# EAGLE board untitled (EAGLE 6.1)
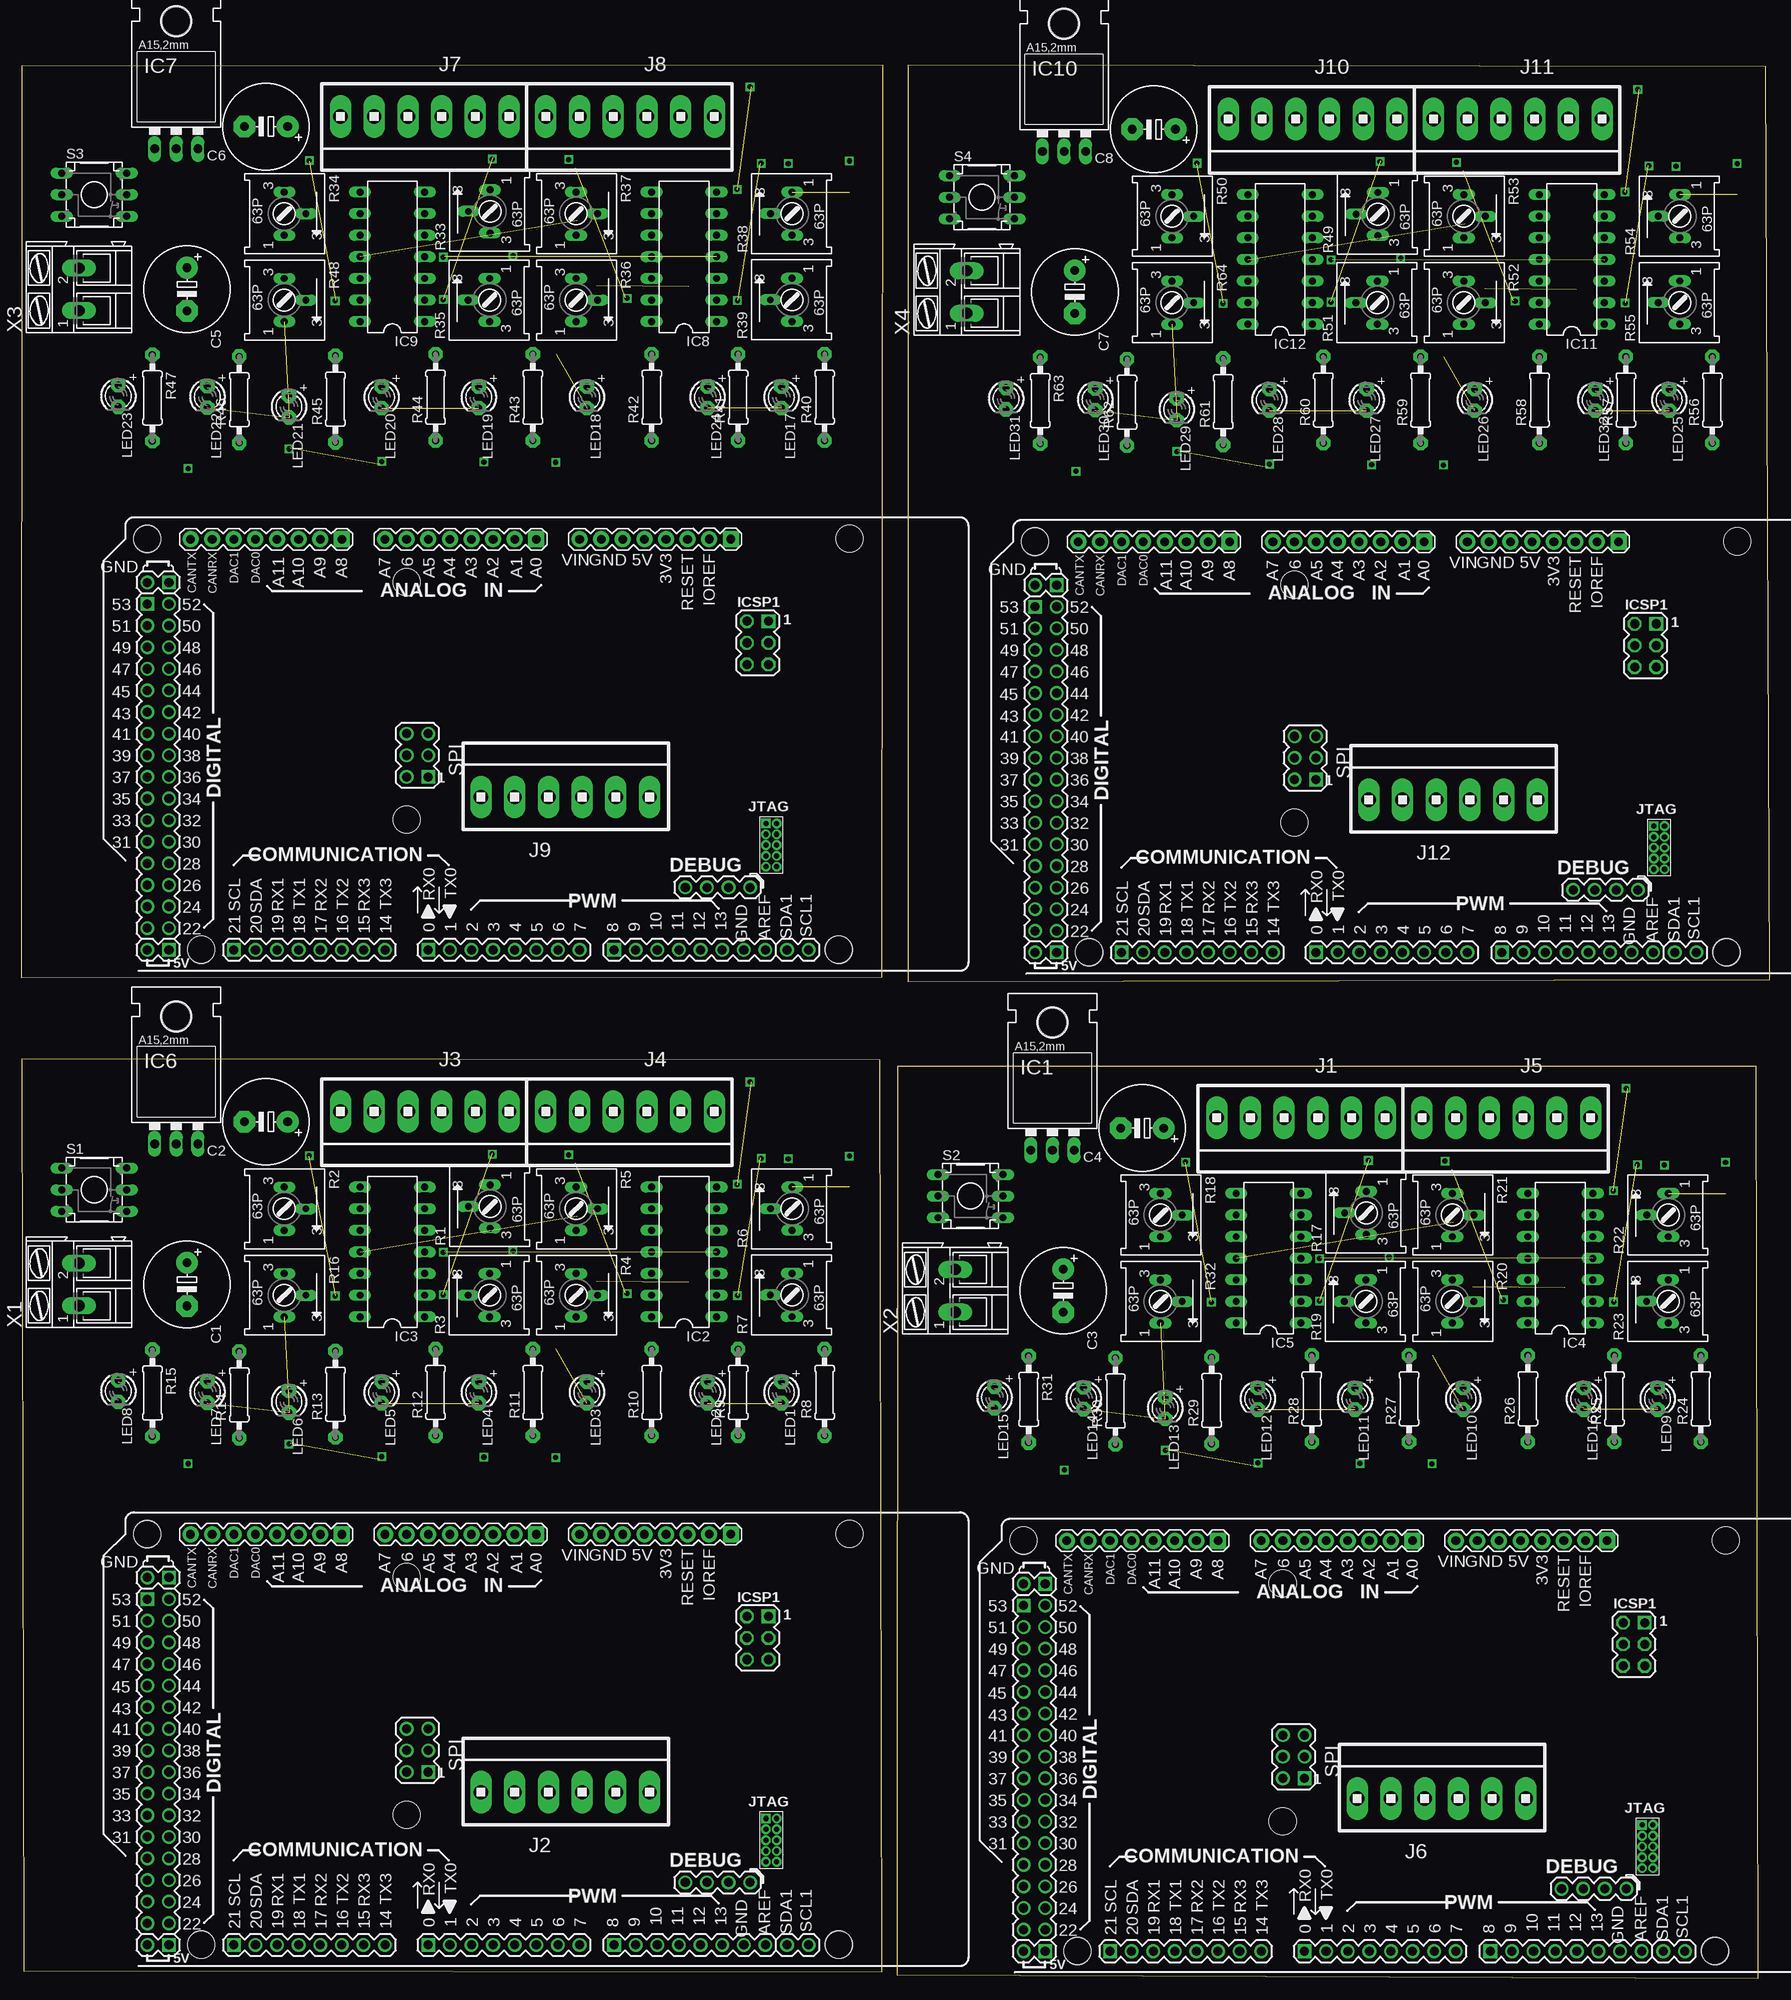
[diagram p4: board, top side]
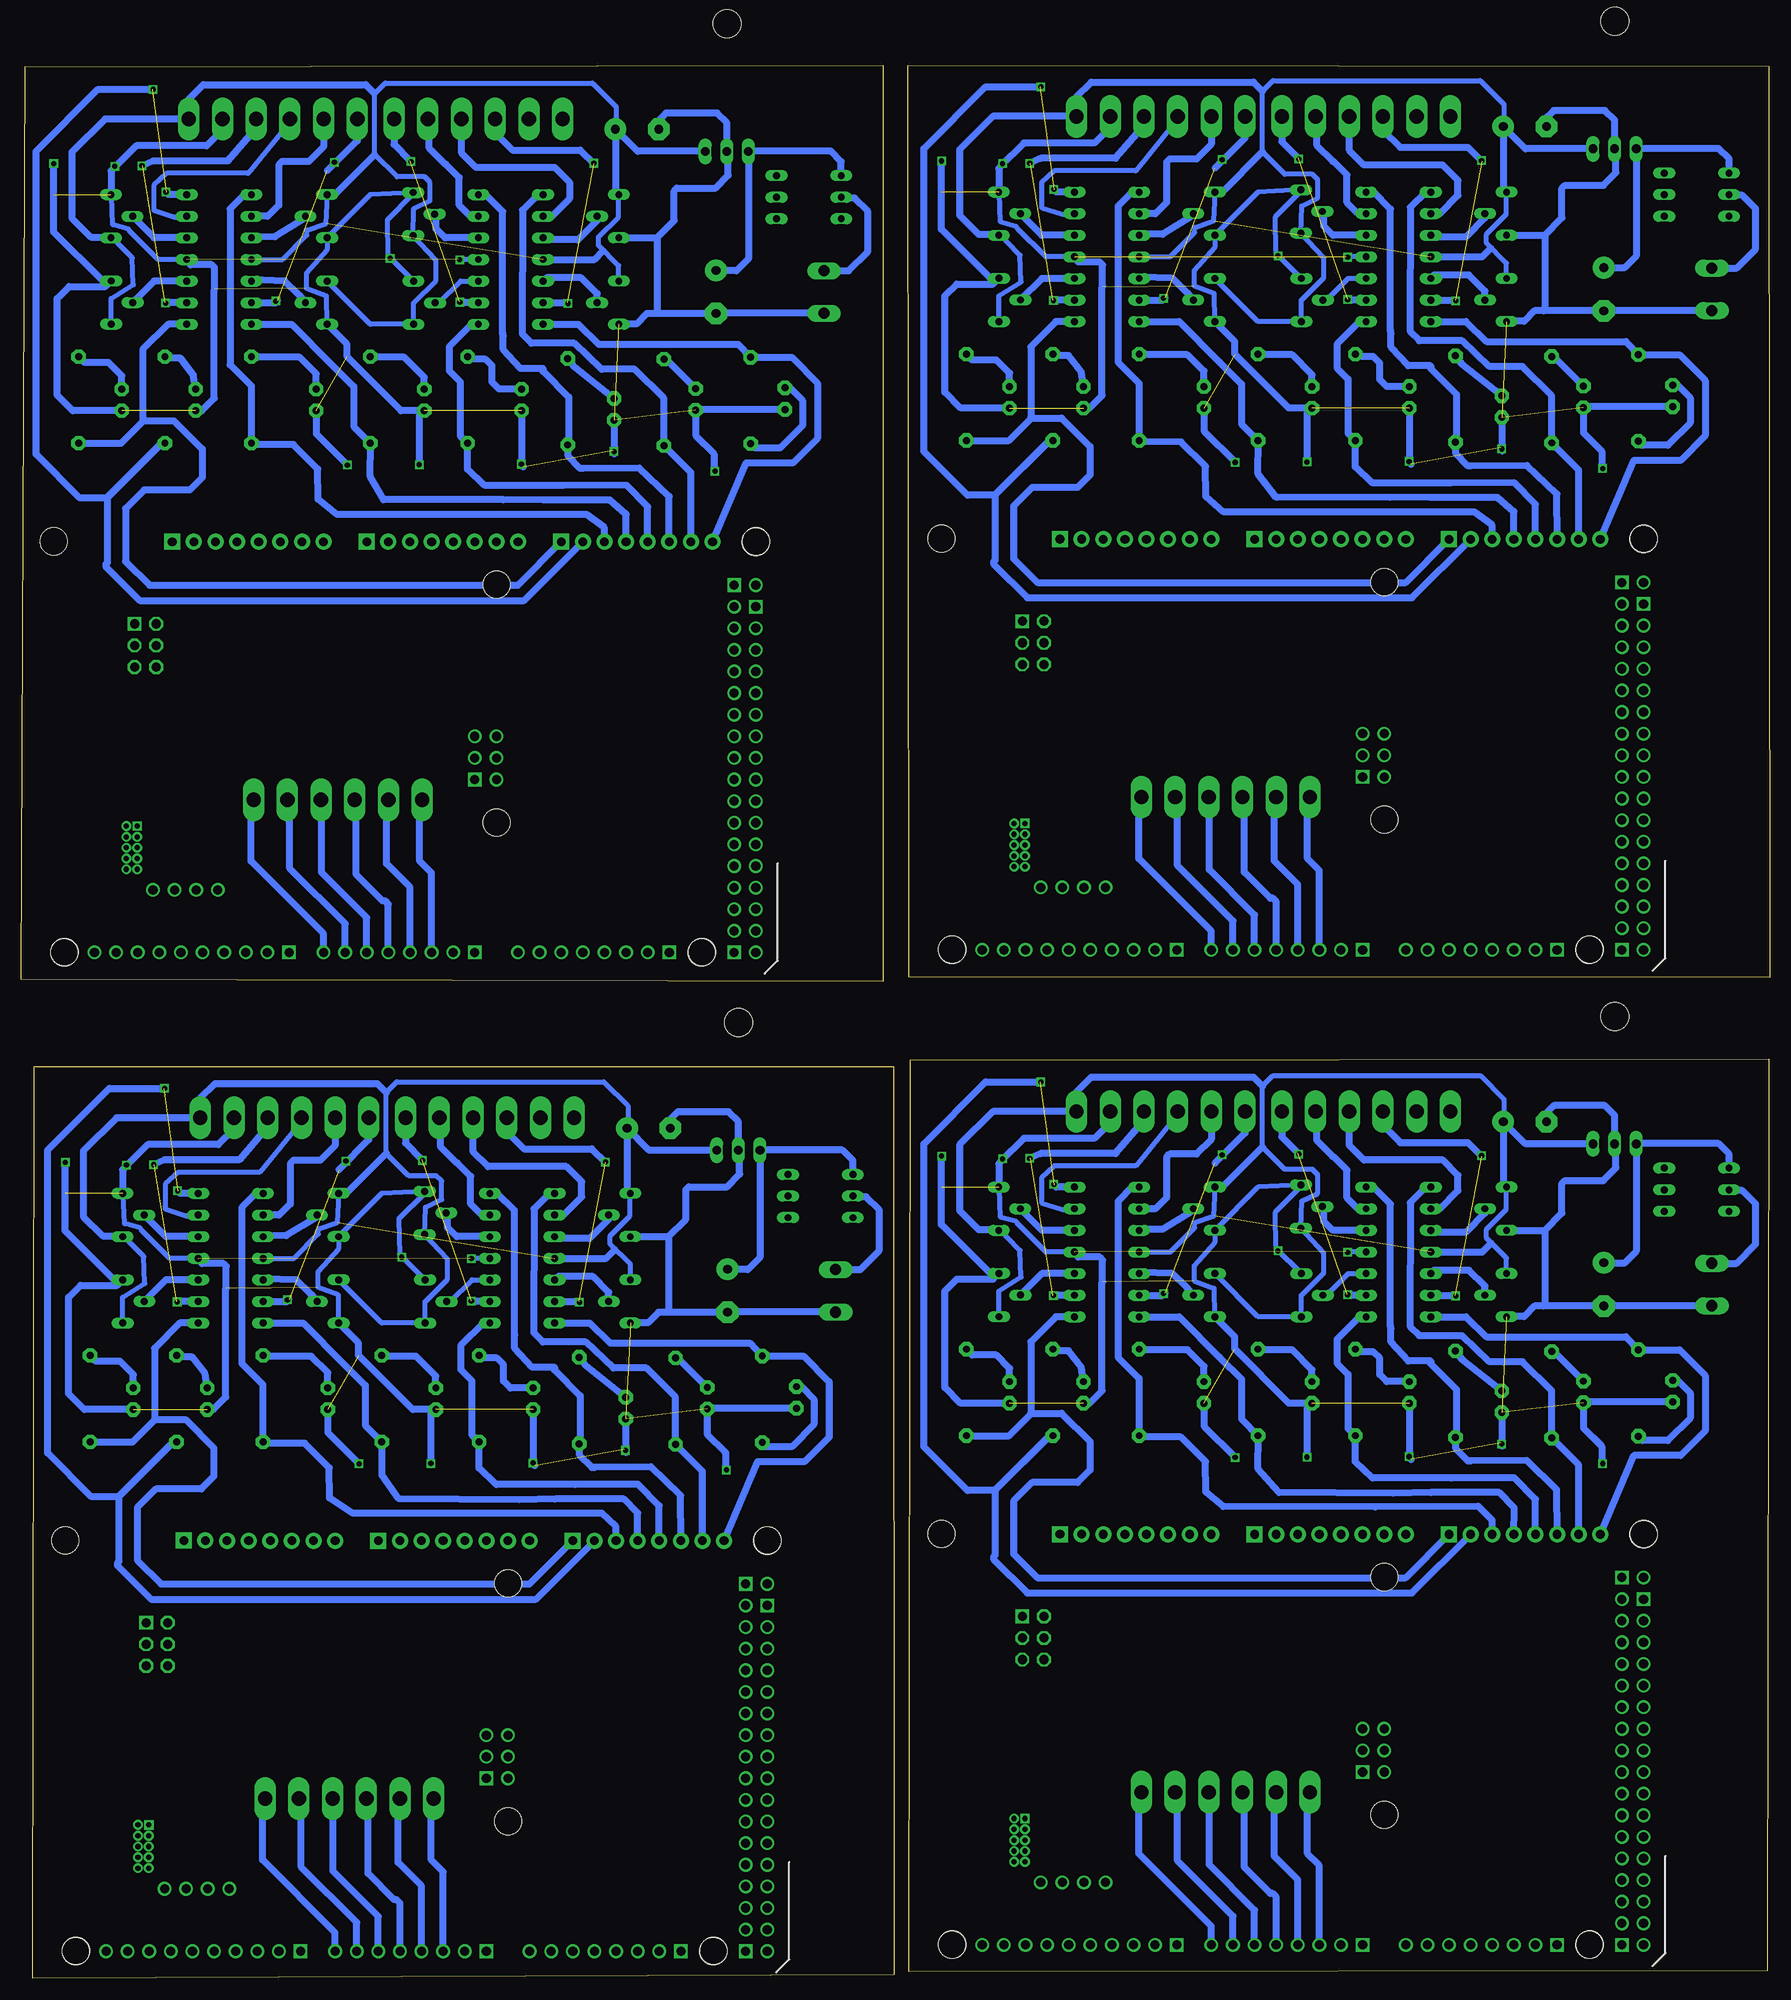
[diagram p5: board, bottom side, seen from below]

Size 205.5 x 224.86 mm. Coordinates in mm from the lower left corner, seen from the top.
Outline: 0.27,0.88 101.15,0.74 100.96,107.9 0.08,108.02 0.27,0.88
Outline: 102.94,0.4 204.14,0 203.94,107.15 103,107.18 102.94,0.4
Outline: 0,117.61 101.15,117.7 101.26,224.86 0.08,224.72 0,117.61
Outline: 104.2,117.17 205.5,117.39 205.05,224.67 104.21,224.83 104.2,117.17
Copper layers (1*16): Top 0.035mm / dielectric 1.5mm / Bottom 0.035mm
Design rules: minimum track width 10mil, minimum drill 24mil, track to track 8mil, track to pad 8mil, pad to pad 8mil, via to via 8mil, smd to smd 8mil, copper to edge 40mil, drill to drill 8mil, minimum pad ring 10mil, minimum via ring 8mil, stop-mask expansion 4mil, vias tented up to drill 0mil, thermal gap 10mil

## Footprints (pad centres in the part's own frame; a part is rotated, then mirrored left to right if it is on the bottom)
ARDUINO_DUE_SHIELD = drill 1.067 square: 0 63.373,51.816; 5V0_1 93.853,51.816; 8 41.529,51.816; 21 86.233,51.816; 53 96.393,11.176; GND_2 93.853,8.636; MISO 63.373,31.496; MISO2 23.384,13.196 | drill 1.067: 1 60.833,51.816; 2 58.293,51.816; 3 55.753,51.816; 4 53.213,51.816; 5 50.673,51.816; 5V0_2 96.393,51.816; 5V_2 65.913,31.496; 6 48.133,51.816; 7 45.593,51.816; 9 38.989,51.816; 10 36.449,51.816; 11 33.909,51.816; 12 31.369,51.816; 13 28.829,51.816; 14 68.453,51.816; 15 70.993,51.816; 16 73.533,51.816; 17 76.073,51.816; 18 78.613,51.816; 19 81.153,51.816; 20 83.693,51.816; 22 93.853,49.276; 23 96.393,49.276; 24 93.853,46.736; 25 96.393,46.736; 26 93.853,44.196; 27 96.393,44.196; 28 93.853,41.656; 29 96.393,41.656; 30 93.853,39.116; 31 96.393,39.116; 32 93.853,36.576; 33 96.393,36.576; 34 93.853,34.036; 35 96.393,34.036; 36 93.853,31.496; 37 96.393,31.496; 38 93.853,28.956; 39 96.393,28.956; 40 93.853,26.416; 41 96.393,26.416; 42 93.853,23.876; 43 96.393,23.876; 44 93.853,21.336; 45 96.393,21.336; 46 93.853,18.796; 47 96.393,18.796; 48 93.853,16.256; 49 96.393,16.256; 50 93.853,13.716; 51 96.393,13.716; 52 93.853,11.176; AREF 23.749,51.816; GND_3 96.393,8.636; GND_4 26.289,51.816; GND_5 65.913,26.416; GND_7 33.161,44.473; JTAG_TCK 30.621,44.473; JTAG_TMS 28.081,44.473; MASTER_RESET_JTAG 25.541,44.473; MASTER_RESET_SPI 63.373,26.416; MOSI 65.913,28.956; SCL1 18.669,51.816; SDA1 21.209,51.816; SPCK 63.373,28.956 | drill 1.016 pad 1.88: 3V3 35.433,3.556; 5V0 37.973,3.556; A1 53.213,3.556; A2 55.753,3.556; A3 58.293,3.556; A4 60.833,3.556; A5 63.373,3.556; A6 65.913,3.556; A7 68.453,3.556; A9 76.073,3.556; A10 78.613,3.556; A11 81.153,3.556; CANRX 88.773,3.556; CANTX 91.313,3.556; DAC0 83.693,3.556; DAC1 86.233,3.556; GND 40.513,3.556; GND_1 43.053,3.556; IOREF 30.346,3.543; RESET 32.893,3.555; VIN 45.593,3.556 | drill 0.6 pad 1.016 square: 3V3_JTAG 23.689,36.964 | drill 1.067 octagon: 5V_ICSP1 25.924,13.196; GND_ICSP1 25.924,18.276; MOSI2 25.924,15.736; RESET2 23.384,18.276; SCK2 23.384,15.736 | drill 1.016 pad 1.88 square: A0 50.673,3.556; A8 73.533,3.556; NC_2 27.806,3.543 | drill 0.6 pad 1.143: GND_8 23.689,38.234; GND_9 23.689,40.774; GND_10 23.689,42.044; JTAG_RESET 22.419,42.044; JTAG_TCK_2 22.419,38.234; JTAG_TDI 22.419,40.774; JTAG_TDO 22.419,39.504; JTAG_TMS_2 22.419,36.964; NC_5 23.689,39.504 | hole 3.2: 15.113,51.816; 90.043,51.816; 96.393,3.556; 96.418,3.505; 15.138,51.765; 90.068,51.765; 13.868,3.505; 65.938,36.525; 65.938,8.585
E5-10,5 = drill 1.016 pad 2.54: + -2.54,0 | drill 1.016 pad 2.54 octagon: - 2.54,0
78XXL = drill 1.016 long: GND 0,-3.81; IN -2.54,-3.81; OUT 2.54,-3.81 | hole 3.302: 0,11.176
DIL14 = drill 0.813 long: 1 -7.62,-3.81; 2 -5.08,-3.81; 3 -2.54,-3.81; 4 0,-3.81; 5 2.54,-3.81; 6 5.08,-3.81; 7 7.62,-3.81; 8 7.62,3.81; 9 5.08,3.81; 10 2.54,3.81; 11 0,3.81; 12 -2.54,3.81; 13 -5.08,3.81; 14 -7.62,3.81
1X6MTA = drill 1.676 long: 1 9.906,0; 2 5.944,0; 3 1.981,0; 4 -1.981,0; 5 -5.944,0; 6 -9.906,0
LED3MM = drill 0.813 pad 1.676 octagon: A -1.27,0; K 1.27,0
S63P = drill 0.813 long: A 2.54,0; E -2.54,0; S 0,2.54
0207/10 = drill 0.813 pad 1.676 octagon: 1 -5.08,0; 2 5.08,0
TME1 = drill 0.813 long: 1 -2.54,-3.81; 2 0,-3.81; 3 2.54,-3.81; 4 2.54,3.81; 5 0,3.81; 6 -2.54,3.81
AK300/2 = drill 1.321 long: 1 -2.515,0; 2 2.489,0

## Placement (x,y rotation side)
ARDUINO_DUE1  [ARDUINO_DUE_SHIELD]  111.21,55.73 180 top
ARDUINO_DUE2  [ARDUINO_DUE_SHIELD]  214.2,54.99 180 top
ARDUINO_DUE3  [ARDUINO_DUE_SHIELD]  111.21,172.69 180 top
ARDUINO_DUE4  [ARDUINO_DUE_SHIELD]  215.56,172.38 180 top
C1  [E5-10,5]  19.49,81.55 270 top
C2  [E5-10,5]  28.77,100.67 180 top
C3  [E5-10,5]  122.48,80.81 270 top
C4  [E5-10,5]  131.75,99.92 180 top
C5  [E5-10,5]  19.49,198.51 270 top
C6  [E5-10,5]  28.77,217.63 180 top
C7  [E5-10,5]  123.83,198.2 270 top
C8  [E5-10,5]  133.11,217.32 180 top
IC1  [78XXL]  121.21,101.13 0 top
IC2  LM2902N  [DIL14]  77.91,85.36 90 top
IC3  LM2902N  [DIL14]  43.62,85.36 90 top
IC4  LM2902N  [DIL14]  180.9,84.62 90 top
IC5  LM2902N  [DIL14]  146.61,84.62 90 top
IC6  [78XXL]  18.22,101.87 0 top
IC7  [78XXL]  18.22,218.83 0 top
IC8  LM2902N  [DIL14]  77.91,202.32 90 top
IC9  LM2902N  [DIL14]  43.62,202.32 90 top
IC10  [78XXL]  122.56,218.52 0 top
IC11  LM2902N  [DIL14]  182.25,202.01 90 top
IC12  LM2902N  [DIL14]  147.96,202.01 90 top
J1  [1X6MTA]  150.42,101.13 180 top
J2  [1X6MTA]  63.94,21.86 0 top
J3  [1X6MTA]  47.43,101.87 180 top
J4  [1X6MTA]  71.56,101.87 180 top
J5  [1X6MTA]  174.55,101.13 180 top
J6  [1X6MTA]  166.93,21.12 0 top
J7  [1X6MTA]  47.43,218.83 180 top
J8  [1X6MTA]  71.56,218.83 180 top
J9  [1X6MTA]  63.94,138.82 0 top
J10  [1X6MTA]  151.77,218.52 180 top
J11  [1X6MTA]  175.9,218.52 180 top
J12  [1X6MTA]  168.28,138.51 0 top
LED1  [LED3MM]  89.34,68.85 270 top
LED2  [LED3MM]  80.65,68.85 270 top
LED3  [LED3MM]  66.48,68.85 270 top
LED4  [LED3MM]  53.78,68.85 270 top
LED5  [LED3MM]  42.35,68.85 270 top
LED6  [LED3MM]  31.46,67.76 270 top
LED7  [LED3MM]  21.88,68.91 270 top
LED8  [LED3MM]  11.4,69 270 top
LED9  [LED3MM]  192.33,68.11 270 top
LED10  [LED3MM]  169.47,68.11 270 top
LED11  [LED3MM]  156.77,68.11 270 top
LED12  [LED3MM]  145.34,68.11 270 top
LED13  [LED3MM]  134.45,67.01 270 top
LED14  [LED3MM]  124.86,68.17 270 top
LED15  [LED3MM]  114.39,68.26 270 top
LED16  [LED3MM]  183.64,68.11 270 top
LED17  [LED3MM]  89.34,185.81 270 top
LED18  [LED3MM]  66.48,185.81 270 top
LED19  [LED3MM]  53.78,185.81 270 top
LED20  [LED3MM]  42.35,185.81 270 top
LED21  [LED3MM]  31.46,184.72 270 top
LED22  [LED3MM]  21.88,185.87 270 top
LED23  [LED3MM]  11.4,185.96 270 top
LED24  [LED3MM]  80.65,185.81 270 top
LED25  [LED3MM]  193.68,185.5 270 top
LED26  [LED3MM]  170.82,185.5 270 top
LED27  [LED3MM]  158.12,185.5 270 top
LED28  [LED3MM]  146.69,185.5 270 top
LED29  [LED3MM]  135.81,184.41 270 top
LED30  [LED3MM]  126.22,185.56 270 top
LED31  [LED3MM]  115.75,185.66 270 top
LED32  [LED3MM]  185,185.5 270 top
R1  [S63P]  55.09,90.7 90 top
R2  [S63P]  30.92,90.44 270 top
R3  [S63P]  55.05,80.28 90 top
R4  [S63P]  65.21,80.28 270 top
R5  [S63P]  65.21,90.44 270 top
R6  [S63P]  90.61,90.44 90 top
R7  [S63P]  90.58,80.3 90 top
R8  [0207/10]  94.42,68.85 90 top
R9  [0207/10]  84.26,68.85 90 top
R10  [0207/10]  74.1,68.85 90 top
R11  [0207/10]  60.13,68.85 90 top
R12  [0207/10]  48.7,68.85 90 top
R13  [0207/10]  36.92,68.65 90 top
R14  [0207/10]  25.62,68.57 90 top
R15  [0207/10]  15.41,68.78 270 top
R16  [S63P]  30.92,80.28 270 top
R17  [S63P]  158.08,89.96 90 top
R18  [S63P]  133.91,89.7 270 top
R19  [S63P]  158.04,79.54 90 top
R20  [S63P]  168.2,79.54 270 top
R21  [S63P]  168.2,89.7 270 top
R22  [S63P]  193.6,89.7 90 top
R23  [S63P]  193.57,79.56 90 top
R24  [0207/10]  197.41,68.11 90 top
R25  [0207/10]  187.25,68.11 90 top
R26  [0207/10]  177.09,68.11 90 top
R27  [0207/10]  163.12,68.11 90 top
R28  [0207/10]  151.69,68.11 90 top
R29  [0207/10]  139.91,67.9 90 top
R30  [0207/10]  128.61,67.83 90 top
R31  [0207/10]  118.4,68.04 270 top
R32  [S63P]  133.91,79.54 270 top
R33  [S63P]  55.09,207.66 90 top
R34  [S63P]  30.92,207.4 270 top
R35  [S63P]  55.05,197.24 90 top
R36  [S63P]  65.21,197.24 270 top
R37  [S63P]  65.21,207.4 270 top
R38  [S63P]  90.61,207.4 90 top
R39  [S63P]  90.58,197.26 90 top
R40  [0207/10]  94.42,185.81 90 top
R41  [0207/10]  84.26,185.81 90 top
R42  [0207/10]  74.1,185.81 90 top
R43  [0207/10]  60.13,185.81 90 top
R44  [0207/10]  48.7,185.81 90 top
R45  [0207/10]  36.92,185.61 90 top
R46  [0207/10]  25.62,185.53 90 top
R47  [0207/10]  15.41,185.74 270 top
R48  [S63P]  30.92,197.24 270 top
R49  [S63P]  159.44,207.35 90 top
R50  [S63P]  135.26,207.09 270 top
R51  [S63P]  159.39,196.93 90 top
R52  [S63P]  169.55,196.93 270 top
R53  [S63P]  169.55,207.09 270 top
R54  [S63P]  194.95,207.09 90 top
R55  [S63P]  194.93,196.95 90 top
R56  [0207/10]  198.76,185.5 90 top
R57  [0207/10]  188.6,185.5 90 top
R58  [0207/10]  178.44,185.5 90 top
R59  [0207/10]  164.47,185.5 90 top
R60  [0207/10]  153.04,185.5 90 top
R61  [0207/10]  141.27,185.3 90 top
R62  [0207/10]  129.96,185.22 90 top
R63  [0207/10]  119.76,185.43 270 top
R64  [S63P]  135.26,196.93 270 top
S1  TME1  [TME1]  8.58,92.67 270 top
S2  TME1  [TME1]  111.57,91.93 270 top
S3  TME1  [TME1]  8.58,209.63 270 top
S4  TME1  [TME1]  112.93,209.32 270 top
X1  [AK300/2]  6.79,81.55 90 top
X2  [AK300/2]  109.78,80.81 90 top
X3  [AK300/2]  6.79,198.51 90 top
X4  [AK300/2]  111.13,198.2 90 top

## Tracks (layer width: path | path; a pad name or v marks a point on that pad's centre or on a via)
N$1
  Bottom 0.813: ARDUINO_DUE1.7 65.62,6.11 74.15,14.64 74.15,21.56 J2.1
N$2  (1 unrouted)
  Bottom 0.813: IC2.2 84.25,80.28 84.3,80.23 | J4.4 73.54,100.79 76.86,96.93 85.7,96.93 86.89,96.39
N$3
  Bottom 0.813: ARDUINO_DUE1.6 63.08,7.3 69.58,13.8 69.58,21.56 J2.2
N$4
  Bottom 0.61: J4.3 69.58,101.52 74.49,95.47 84.06,95.47 85.57,94.08 85.58,91.14 83.11,90.35 81.81,90.35 IC2.6
N$5
  Bottom 0.813: IC2.5 85.53,87.9 R6.S
N$6
  Bottom 0.813: IC2.3 85.53,82.82 R7.S
N$7
  Bottom 0.813: R5.S 67.75,90.25 71.36,88.02 73.99,88.01 IC2.10
N$8
  Bottom 0.813: R4.S 68.51,81.17 70.17,82.82 73.96,82.96 IC2.12
N$9
  Bottom 0.61: R3.S 52.08,80.28 49.53,82.83 IC3.3
N$10
  Bottom 0.813: IC3.5 51.32,87.9 52.4,88.98 52.4,90.33 R1.S
N$11
  Bottom 0.813: R2.S 33.46,89.94 35.71,87.68 39.59,87.68 IC3.10
N$12
  Bottom 0.813: R16.S 33.46,81.35 35.32,83.22 39.41,83.22 IC3.12
N$13
  Bottom 0.813: R8.1 89.42,63.77 86.78,66.41 | 86.78,66.41 83.21,66.41 79.87,63.07 79.87,59.73 81.35,58.26 86.7,58.26 88.87,56.08 88.87,49.87 86.08,47.08 42.78,47.08 ARDUINO_DUE1.A8 | IC2.1 83.9,77.74 86.85,74.8 86.85,66.48 86.78,66.41
N$14
  Bottom 0.813: LED1.A 89.34,71.7 90.88,73.24 93.73,73.24 R8.2
N$15  (1 unrouted)
  Bottom 0.813: ARDUINO_DUE1.A9 42.02,45.29 87.24,45.29 91.2,49.25 91.2,49.56 91.05,49.72 91.05,57.4 84.68,63.77 R9.1 84.59,63.77 91.03,57.33 94.27,57.33 99.41,62.47 99.41,98.08 92.15,105.34 85.78,105.34 | IC2.7 83.83,92.98 84.1,93.25
N$16
  Bottom 0.813: LED2.A 80.91,71.81 82.39,73.75 84.07,73.75 R9.2
N$17
  Bottom 0.813: ARDUINO_DUE1.A10 32.6,53.82 34.25,55.49 46.34,55.38 64.21,55.44 66.28,57.18 66.31,60.74 69.18,63.61 73.94,63.61 R10.1 74.12,63.79 74.12,70.51 76.59,72.99 76.59,91.32 74.94,92.98 IC2.8
N$18
  Bottom 0.813: LED3.A 66.48,71.93 68.4,73.85 74.02,73.85 R10.2
N$19
  Bottom 0.813: ARDUINO_DUE1.A11 30.03,55.29 31.78,57.09 39.81,57.09 44.23,56.99 57.67,57.09 60.12,59.85 60.11,63.76 R11.1 62.08,65.72 62.08,70.42 64.65,72.99 69.4,77.74 IC2.14
N$20
  Bottom 0.813: ARDUINO_DUE1.DAC0 27.52,56.28 30.02,58.81 37.44,58.78 46.68,58.78 48.7,60.7 R12.1 49.55,64.62 49.55,71 50.84,72.29 50.84,75.09 48.19,77.74 IC3.1
N$21
  Bottom 0.813: ARDUINO_DUE1.DAC1 25.03,57.42 28.51,60.85 35.16,60.78 35.44,60.78 36.88,62.22 36.88,63.52 R13.1 36.8,63.69 36.8,69.2 39.83,72.23 39.83,72.54 42.46,72.54 44.49,74.76 44.49,76.37 44.55,76.72 44.55,90.99 46.5,92.94 47.39,92.94 IC3.7
N$22
  Bottom 0.813: IC3.8 40.43,92.98 42.23,91.18 42.28,76.63 41.19,75.54 41.18,75.51 36.14,75.51 32.92,72.47 29.04,72.47 25.62,69.04 R14.1 22.44,60.32 ARDUINO_DUE1.CANRX
N$23
  Bottom 0.813: LED4.A 53.78,71.51 56.12,73.85 60.05,73.85 R11.2
N$24
  Bottom 0.813: LED5.A 45.01,70.12 45.83,70.94 45.83,72.88 46.58,73.64 48.4,73.64 R12.2
N$25
  Bottom 0.813: R13.2 36.16,72.75 LED6.A
N$26
  Bottom 0.813: R14.2 25.35,73.65 LED7.A
N$27
  Bottom 0.813: IC3.14 35.69,77.74 33.28,75.4 16.88,75.4 R15.1 10.58,73.86 7.56,70.85 7.56,64.32 10.45,61.44 15.96,61.44 ARDUINO_DUE1.CANTX
N$28
  Bottom 0.813: LED8.A 10.81,70.27 9.33,68.8 9.33,65.81 11.94,63.21 14.92,63.21 R15.2
N$29
  Bottom 0.813: J4.2 65.61,98.6 67.35,96.86 70.52,96.86 70.89,96.49 70.89,91.73 72.2,90.43 74.08,90.43 IC2.9
N$30
  Bottom 0.813: ARDUINO_DUE1.5 60.54,8.02 65.86,13.33 65.86,21.8 J2.3
N$31  (1 unrouted)
  Bottom 0.813: IC2.13 71.29,80.28 71.03,80.54 | J4.1 61.65,99.32 65.17,95.8
N$32  (1 unrouted)
  Bottom 0.813: IC3.2 49.52,80.28 49.61,80.37 | J3.6 57.33,98.9 55.43,97
N$33
  Bottom 0.813: IC3.6 48.38,90.44 49.67,91.73 49.67,95 51.25,96.58 51.35,96.58 53.21,98.44 53.21,101.71 J3.5
N$34
  Bottom 0.813: IC3.9 38.78,90.44 36.64,92.58 36.64,94.36 38.43,96.15 47.66,96.15 49.37,97.86 49.37,101.83 J3.4
N$35
  Bottom 0.813: ARDUINO_DUE1.4 58,9.57 58.41,9.98 58.68,9.98 61.76,13.05 61.76,21.07 62.04,21.35 62.04,21.78 J2.4
N$36
  Bottom 0.813: ARDUINO_DUE1.3 55.46,11.6 58.22,14.36 58.22,21.64 J2.5
N$37
  Bottom 0.813: ARDUINO_DUE1.2 52.92,13.25 54.31,14.64 54.31,21.58 J2.6
N$38  (1 unrouted)
  Bottom 0.813: J3.3 45.45,100.26 43.41,98.23 35.45,98.23 33.84,96.61 | IC3.13 36.92,80.28 36.82,80.17
N$39
  Bottom 0.813: X1.2 3.89,84.04 1.64,86.29 1.64,91.02 3.2,92.58 4.68,92.58 S1.2
N$40  (via drill 0.6 pad 0.61)
  other vias: 55.35,96.86
N$41
  Bottom 0.61: R7.E 90.59,80.77 87.97,82.4 88.09,85.56 89.65,87.12 90.45,88.06 R6.E | R4.E 60.13,77.74 R3.E 55.05,80.26 52.41,82.89 52.41,85.27 R1.E 55,91.34 53.1,92.27 53.1,94.44 53.72,95.06 56.98,95.06 59.62,97.7 59.62,104.85 58.37,106.09 34.01,106.09 31.21,103.29 31.21,100.26 31.13,100.19 31.13,100.49 C2.+ | R16.E 30.92,84.64 33.29,87.01 33.29,88.01 30.96,90.35 30.96,92.94 R2.E
  Bottom 0.813: IC6.OUT 28.7,98.06 C2.+ 31.31,93.37 R2.E | R6.E 90.71,88 92.96,88 95.2,90.24 95.2,97.98 91.3,101.87 J4.6 81.46,104.18 79.74,105.9 60.67,105.9 59.62,104.85 | R5.E 64.33,92.98 59.62,97.7
N$42  (via drill 0.6 pad 0.61)
  other vias: 84.14,93.3
N$43  (via drill 0.6 pad 0.61)
  other vias: 85.66,105.34
N$44  (via drill 0.6 pad 0.61)
  other vias: 64.35,96.78
N$45  (via drill 0.6 pad 0.61)
  other vias: 71.23,80.48
N$46  (via drill 0.6 pad 0.61)
  other vias: 62.82,61.2
N$47  (via drill 0.6 pad 0.61)
  other vias: 54.37,61.24
N$48  (via drill 0.6 pad 0.61)
  other vias: 42.37,61.3
N$49  (via drill 0.6 pad 0.61)
  other vias: 31.48,62.78
N$50  (via drill 0.6 pad 0.61)
  other vias: 19.62,60.48
N$51  (via drill 0.6 pad 0.61)
  other vias: 49.6,80.34
N$52  (via drill 0.6 pad 0.61)
  other vias: 33.85,96.67
N$53  (via drill 0.6 pad 0.61)
  other vias: 36.9,80.19
N$54  (via drill 0.6 pad 0.61)
  other vias: 90.15,96.31
N$55  (via drill 0.6 pad 0.61)  (8 unrouted)
  Bottom 0.61: R3.A 58.06,85.84 58.14,89.99 55.13,93.01 R1.A 60.13,92.98 R5.A 65.21,86.48 67.65,83.73 67.65,81.97 65.29,81.09 65.24,77.77 R4.A
  Bottom 0.813: X1.1 19.49,79.04 C1.- 26.59,79.01 | C2.- 26.46,100.91 26.46,101.46 25.36,102.56 19.35,102.56 18.22,101.43 IC6.GND 18.06,97.9 18.06,95.25 19.54,93.76 24.07,93.76 24.39,93.44 24.39,89.95 26.44,87.9 | R2.A 26.44,87.9 | 26.59,79.01 27.63,79.01 28.86,77.78 30.88,77.78 R16.A | 26.44,87.9 26.44,79.17 26.59,79.01 | LED8.K 21.78,67.73 LED7.K 21.88,64.68 | LED1.K 95.08,67.58 96.94,69.44 96.94,80.78 95.54,82.17 91.26,82.17 R7.A 91.6,82.84 97.35,88.59 97.35,92.86 97.35,92.99 97.35,96.51 v97.33,96.63 | J4.5 77.5,100.58 79.36,98.72 87.65,98.72 90.44,95.93 90.44,95.9 90.59,95.75 90.59,93 R6.A | R4.A 62.87,75.4 62.87,73.94 56.51,67.58 LED4.K 54.34,67.02 54.34,61.13 54.42,61.21 | 81.92,85.4 81.26,84.75 78.74,84.75 78.42,84.42 78.42,81.87 78.46,81.82 78.46,69.05 79.93,67.58 LED2.K | LED6.K 31.46,63.05 | 31.46,63.05 31.6,62.92 | 21.88,64.68 19.8,62.61 | LED5.K 42.35,61.71 42.46,61.6 42.46,61.28 42.15,60.97 | 31.46,63.05 31.46,62.54 31.44,62.53 | 21.88,64.68 | 21.88,64.68 19.73,62.53 19.73,60.51 19.57,60.35 | LED3.K 66.48,64.89 62.8,61.21
N$56  (via drill 0.6 pad 0.61)
  other vias: 86.96,96.36
N$57  (via drill 0.6 pad 0.61)
  other vias: 84.18,80.23
N$58  (via drill 0.6)
  other vias: 49.6,85.32
N$59  (via drill 0.6)
  other vias: 57.79,85.49
N$60
  Bottom 0.813: IC4.5 188.52,87.16 R22.S
N$61
  Bottom 0.813: IC4.3 188.52,82.08 R23.S
N$62
  Bottom 0.813: R21.S 170.74,89.5 174.34,87.28 176.98,87.26 IC4.10
N$63
  Bottom 0.813: S1.1 4.77,96.87 5.99,98.09 15.65,98.09 IC6.IN 15.68,85.44 17.09,84.04 19.43,84.04 C1.+
N$64
  Bottom 0.813: R20.S 171.5,80.42 173.16,82.08 176.95,82.22 IC4.12
N$65
  Bottom 0.61: R19.S 155.06,79.54 152.52,82.08 IC5.3
N$66
  Bottom 0.813: IC5.5 154.31,87.16 155.39,88.23 155.39,89.59 R17.S
N$67
  Bottom 0.813: R18.S 136.45,89.19 138.7,86.94 142.58,86.94 IC5.10
N$68
  Bottom 0.813: R32.S 136.45,80.61 138.31,82.48 142.4,82.48 IC5.12
N$69
  Bottom 0.813: R24.1 192.4,63.03 189.77,65.67 | 189.77,65.67 186.2,65.67 182.86,62.33 182.86,58.99 184.33,57.51 189.69,57.51 191.86,55.34 191.86,49.13 189.07,46.33 145.77,46.33 ARDUINO_DUE2.A8 | IC4.1 186.89,77 189.84,74.05 189.84,65.74 189.77,65.67
N$70  (1 unrouted)
  Bottom 0.813: ARDUINO_DUE2.A9 145.01,44.55 190.23,44.55 194.19,48.51 194.19,48.82 194.03,48.97 194.03,56.66 187.67,63.03 R25.1 187.57,63.03 194.02,56.58 197.25,56.58 202.4,61.73 202.4,97.33 195.14,104.6 188.77,104.6 | IC4.7 186.82,92.24 187.09,92.51
N$71
  Bottom 0.813: ARDUINO_DUE2.A10 135.59,53.08 137.24,54.64 149.33,54.64 166.53,54.64 169.27,56.44 169.29,59.99 172.17,62.86 176.93,62.87 R26.1 177.1,63.05 177.1,69.77 179.58,72.25 179.58,90.58 177.92,92.24 IC4.8
N$72
  Bottom 0.813: LED10.A 169.47,71.18 171.39,73.11 177.01,73.11 R26.2
N$73
  Bottom 0.813: ARDUINO_DUE2.A11 133.05,54.68 134.67,56.31 142.76,56.34 146.93,56.25 161.14,56.35 163.11,59.11 163.1,63.01 R27.1 165.07,64.98 165.07,69.68 167.64,72.25 172.38,77 IC4.14
N$74
  Bottom 0.813: ARDUINO_DUE2.DAC0 130.51,55.54 133,58.07 140.43,58.04 149.67,58.04 151.69,59.95 R28.1 152.53,63.88 152.53,70.25 153.83,71.55 153.83,74.35 151.18,77 IC5.1
N$75
  Bottom 0.813: ARDUINO_DUE2.DAC1 127.98,56.75 131.5,60.1 138.15,60.04 138.43,60.04 139.86,61.47 139.86,62.78 R29.1 139.79,62.95 139.79,68.46 142.81,71.49 142.81,71.8 145.45,71.8 147.48,74.02 147.48,75.62 147.54,75.98 147.54,90.24 149.49,92.2 150.38,92.2 IC5.7
N$76
  Bottom 0.813: IC5.8 143.42,92.24 145.22,90.44 145.26,75.89 144.18,74.8 144.17,74.76 139.13,74.76 135.91,71.72 132.03,71.72 128.61,68.3 R30.1 125.43,59.57 ARDUINO_DUE2.CANRX
N$77
  Bottom 0.813: LED11.A 156.77,70.77 159.11,73.11 163.04,73.11 R27.2
N$78
  Bottom 0.813: LED12.A 148,69.38 148.82,70.2 148.82,72.14 149.57,72.9 151.39,72.9 R28.2
N$79
  Bottom 0.813: R29.2 139.15,72.01 LED13.A
N$80
  Bottom 0.813: R30.2 128.34,72.91 LED14.A
N$81
  Bottom 0.813: IC5.14 138.68,77 136.26,74.66 119.87,74.66 R31.1 113.56,73.12 110.55,70.11 110.55,63.58 113.44,60.69 118.95,60.69 ARDUINO_DUE2.CANTX
N$82
  Bottom 0.813: LED15.A 113.8,69.53 112.32,68.06 112.32,65.07 114.93,62.46 117.91,62.46 R31.2
N$83
  Bottom 0.813: LED9.A 192.33,70.95 193.87,72.5 196.72,72.5 R24.2
N$84
  Bottom 0.813: LED16.A 183.9,71.07 185.38,73 187.06,73 R25.2
N$85  (1 unrouted)
  Bottom 0.813: IC4.2 187.24,79.54 187.29,79.49 | J5.4 176.53,100.05 179.85,96.19 188.69,96.19 189.87,95.65
N$86
  Bottom 0.61: J5.3 172.56,100.78 177.48,94.73 187.05,94.73 188.56,93.33 188.57,90.4 186.1,89.61 184.8,89.61 IC4.6
N$87
  Bottom 0.813: J5.2 168.6,97.86 170.34,96.12 173.51,96.12 173.88,95.74 173.88,90.99 175.19,89.68 177.07,89.68 IC4.9
N$88  (1 unrouted)
  Bottom 0.813: IC4.13 174.28,79.54 174.02,79.8 | J5.1 164.64,98.58 168.16,95.05
N$89  (1 unrouted)
  Bottom 0.813: IC5.2 152.51,79.54 152.6,79.63 | J1.6 160.32,98.16 158.42,96.26
N$90
  Bottom 0.813: IC5.6 151.37,89.7 152.66,90.99 152.66,94.25 154.24,95.84 154.33,95.84 156.2,97.7 156.2,100.97 J1.5
N$91
  Bottom 0.813: IC5.9 141.77,89.7 139.63,91.83 139.63,93.62 141.42,95.41 150.65,95.41 152.36,97.11 152.36,101.09 J1.4
N$92  (1 unrouted)
  Bottom 0.813: J1.3 148.43,99.52 146.4,97.48 138.44,97.48 136.83,95.87 | IC5.13 139.91,79.54 139.8,79.43
N$93
  Bottom 0.61: R23.E 193.58,80.03 190.96,81.65 191.08,84.82 192.64,86.38 193.44,87.31 R22.E | R20.E 163.12,77 R19.E 158.04,79.51 155.4,82.15 155.4,84.53 R17.E 157.99,90.59 156.08,91.52 156.08,93.7 156.71,94.32 159.96,94.32 162.6,96.96 162.6,104.1 161.36,105.34 136.99,105.34 134.2,102.55 134.2,99.52 134.12,99.44 134.12,99.75 C4.+ | R32.E 133.91,83.9 136.28,86.27 136.28,87.27 133.94,89.61 133.94,92.2 R18.E
  Bottom 0.813: IC1.OUT 131.69,97.32 C4.+ 134.29,92.63 R18.E | R22.E 193.7,87.26 195.95,87.26 198.19,89.5 198.19,97.24 194.29,101.13 J5.6 184.45,103.43 182.73,105.16 163.66,105.16 162.6,104.1 | R21.E 167.32,92.24 162.6,96.96
N$94  (via drill 0.6 pad 0.61)  (8 unrouted)
  Bottom 0.61: R19.A 161.05,85.1 161.13,89.25 158.11,92.27 R17.A 163.12,92.24 R21.A 168.2,85.74 170.64,82.99 170.64,81.23 168.28,80.35 168.22,77.03 R20.A
  Bottom 0.813: X2.1 122.48,78.29 C3.- 129.58,78.27 | C4.- 129.45,100.16 129.45,100.72 128.35,101.82 122.34,101.82 121.21,100.69 IC1.GND 121.05,97.16 121.05,94.51 122.53,93.02 127.06,93.02 127.38,92.7 127.38,89.2 129.43,87.16 | R18.A 129.43,87.16 | 129.58,78.27 130.62,78.27 131.85,77.04 133.86,77.04 R32.A | 129.43,87.16 129.43,78.42 129.58,78.27 | LED15.K 124.77,66.99 LED14.K 124.86,63.93 | LED9.K 198.07,66.84 199.92,68.7 199.92,80.03 198.53,81.43 194.25,81.43 R23.A 194.59,82.1 200.33,87.85 200.33,92.11 200.34,92.24 200.34,95.77 v200.32,95.89 | J5.5 180.49,99.84 182.35,97.98 190.63,97.98 193.43,95.18 193.43,95.15 193.58,95 193.58,92.25 R22.A | R20.A 165.85,74.66 165.85,73.2 159.5,66.84 LED11.K 157.33,66.28 157.33,60.39 157.4,60.46 | 184.91,84.66 184.25,84 181.73,84 181.4,83.68 181.4,81.12 181.45,81.08 181.45,68.31 182.92,66.84 LED16.K | LED13.K 134.45,62.31 | 134.45,62.31 134.59,62.17 | 124.86,63.93 122.79,61.86 | LED12.K 145.34,60.97 145.45,60.85 145.45,60.54 145.14,60.23 | 134.45,62.31 134.45,61.8 134.43,61.78 | 124.86,63.93 | 124.86,63.93 122.71,61.78 122.71,59.77 122.56,59.61 | LED10.K 169.47,64.15 165.79,60.46
N$95
  Bottom 0.813: S2.1 107.76,96.13 108.98,97.35 118.64,97.35 IC1.IN 118.67,84.7 120.08,83.29 122.42,83.29 C3.+
N$96
  Bottom 0.813: ARDUINO_DUE2.7 168.61,5.37 177.13,13.9 177.13,20.82 J6.1
N$97
  Bottom 0.813: ARDUINO_DUE2.6 166.07,6.55 172.57,13.06 172.57,20.82 J6.2
N$98
  Bottom 0.813: ARDUINO_DUE2.5 163.53,7.27 168.85,12.59 168.85,21.06 J6.3
N$99
  Bottom 0.813: ARDUINO_DUE2.4 160.99,8.83 161.39,9.24 161.67,9.24 164.75,12.31 164.75,20.33 165.03,20.61 165.03,21.04 J6.4
N$100
  Bottom 0.813: ARDUINO_DUE2.3 158.45,10.86 161.21,13.62 161.21,20.89 J6.5
N$101
  Bottom 0.813: ARDUINO_DUE2.2 155.91,12.51 157.3,13.9 157.3,20.84 J6.6
N$102
  Bottom 0.813: X2.2 106.88,83.3 104.63,85.54 104.63,90.28 106.18,91.83 107.66,91.83 S2.2
N$103  (via drill 0.6 pad 0.61)
  other vias: 158.33,96.11
N$104  (via drill 0.6 pad 0.61)
  other vias: 187.13,92.56
N$105  (via drill 0.6 pad 0.61)
  other vias: 188.65,104.6
N$106  (via drill 0.6 pad 0.61)
  other vias: 167.33,96.04
N$107  (via drill 0.6 pad 0.61)
  other vias: 174.22,79.74
N$108  (via drill 0.6 pad 0.61)
  other vias: 165.8,60.46
N$109  (via drill 0.6 pad 0.61)
  other vias: 157.35,60.5
N$110  (via drill 0.6 pad 0.61)
  other vias: 145.36,60.56
N$111  (via drill 0.6 pad 0.61)
  other vias: 134.47,62.04
N$112  (via drill 0.6 pad 0.61)
  other vias: 122.6,59.74
N$113  (via drill 0.6 pad 0.61)
  other vias: 152.59,79.6
N$114  (via drill 0.6 pad 0.61)
  other vias: 136.84,95.93
N$115  (via drill 0.6 pad 0.61)
  other vias: 139.88,79.45
N$116  (via drill 0.6 pad 0.61)
  other vias: 193.14,95.57
N$117  (via drill 0.6 pad 0.61)
  other vias: 189.95,95.62
N$118  (via drill 0.6 pad 0.61)
  other vias: 187.16,79.49
N$119  (via drill 0.6)
  other vias: 152.59,84.58
N$120  (via drill 0.6)
  other vias: 160.78,84.75
N$121
  Bottom 0.813: IC8.5 85.53,204.86 R38.S
N$122
  Bottom 0.813: IC8.3 85.53,199.78 R39.S
N$123
  Bottom 0.813: R37.S 67.75,207.21 71.36,204.98 73.99,204.97 IC8.10
N$124
  Bottom 0.813: R36.S 68.51,198.13 70.17,199.79 73.96,199.92 IC8.12
N$125
  Bottom 0.61: R35.S 52.08,197.24 49.53,199.79 IC9.3
N$126
  Bottom 0.813: IC9.5 51.32,204.86 52.4,205.94 52.4,207.29 R33.S
N$127
  Bottom 0.813: R34.S 33.46,206.9 35.71,204.64 39.59,204.64 IC9.10
N$128
  Bottom 0.813: R48.S 33.46,198.31 35.32,200.18 39.41,200.18 IC9.12
N$129
  Bottom 0.813: R40.1 89.42,180.73 86.78,183.37 | 86.78,183.37 83.21,183.37 79.87,180.03 79.87,176.69 81.35,175.22 86.7,175.22 88.87,173.04 88.87,166.83 86.08,164.04 42.78,164.04 ARDUINO_DUE3.A8 | IC8.1 83.9,194.7 86.85,191.76 86.85,183.44 86.78,183.37
N$130  (1 unrouted)
  Bottom 0.813: ARDUINO_DUE3.A9 42.02,162.25 87.24,162.25 91.2,166.21 91.2,166.52 91.05,166.68 91.05,174.36 84.68,180.73 R41.1 84.59,180.73 91.03,174.29 94.27,174.29 99.41,179.44 99.41,215.04 92.15,222.3 85.78,222.3 | IC8.7 83.83,209.94 84.1,210.22
N$131
  Bottom 0.813: ARDUINO_DUE3.A10 32.6,170.78 34.7,172.35 46.34,172.35 64.18,172.34 66.28,174.14 66.31,177.7 69.18,180.57 73.94,180.58 R42.1 74.12,180.75 74.12,187.47 76.59,189.95 76.59,208.28 74.94,209.94 IC8.8
N$132
  Bottom 0.813: LED18.A 66.48,188.89 68.4,190.82 74.02,190.82 R42.2
N$133
  Bottom 0.813: ARDUINO_DUE3.A11 30.06,172.39 31.96,174.05 39.93,174.05 44.6,174.08 57.96,174.05 60.12,176.81 60.11,180.72 R43.1 62.08,182.68 62.08,187.38 64.65,189.95 64.65,189.96 69.4,194.7 IC8.14
N$134
  Bottom 0.813: ARDUINO_DUE3.DAC0 27.52,173.24 30.02,175.77 37.44,175.75 46.68,175.74 48.7,177.66 R44.1 49.55,181.58 49.55,187.96 50.84,189.25 50.84,192.06 48.19,194.7 IC9.1
N$135
  Bottom 0.813: ARDUINO_DUE3.DAC1 25,174.45 28.51,177.81 35.16,177.75 35.44,177.75 36.88,179.18 36.88,180.48 R45.1 36.8,180.65 36.8,186.17 39.83,189.19 39.83,189.5 42.46,189.5 44.49,191.72 44.49,193.33 44.55,193.68 44.55,207.95 46.5,209.9 47.39,209.9 IC9.7
N$136
  Bottom 0.813: IC9.8 40.43,209.94 42.23,208.14 42.28,193.59 41.19,192.5 41.18,192.47 36.14,192.47 32.92,189.43 29.04,189.43 25.62,186.01 R46.1 22.44,177.28 ARDUINO_DUE3.CANRX
N$137
  Bottom 0.813: LED19.A 53.78,188.47 56.12,190.82 60.05,190.82 R43.2
N$138
  Bottom 0.813: LED20.A 45.01,187.08 45.83,187.9 45.83,189.85 46.58,190.6 48.4,190.6 R44.2
N$139
  Bottom 0.813: R45.2 36.16,189.71 LED21.A
N$140
  Bottom 0.813: R46.2 25.35,190.61 LED22.A
N$141
  Bottom 0.813: IC9.14 35.69,194.7 33.28,192.36 16.88,192.36 R47.1 10.58,190.82 7.56,187.81 7.56,181.28 10.45,178.4 15.96,178.4 ARDUINO_DUE3.CANTX
N$142
  Bottom 0.813: LED23.A 10.81,187.23 9.33,185.76 9.33,182.78 11.94,180.17 14.92,180.17 R47.2
N$143
  Bottom 0.813: LED17.A 89.34,188.66 90.88,190.2 93.73,190.2 R40.2
N$144
  Bottom 0.813: LED24.A 80.91,188.77 82.39,190.71 84.07,190.71 R41.2
N$145  (1 unrouted)
  Bottom 0.813: IC8.2 84.25,197.24 84.3,197.19 | J8.4 73.54,217.76 76.86,213.89 85.7,213.89 86.89,213.35
N$146
  Bottom 0.61: J8.3 69.58,218.48 74.49,212.44 84.06,212.44 85.57,211.04 85.58,208.1 83.11,207.31 81.81,207.31 IC8.6
N$147
  Bottom 0.813: J8.2 65.61,215.56 67.35,213.82 70.52,213.82 70.89,213.45 70.89,208.69 72.2,207.39 74.08,207.39 IC8.9
N$148  (1 unrouted)
  Bottom 0.813: IC8.13 71.29,197.24 71.03,197.5 | J8.1 61.65,216.28 65.17,212.76
N$149  (1 unrouted)
  Bottom 0.813: IC9.2 49.52,197.24 49.61,197.33 | J7.6 57.33,215.86 55.43,213.96
N$150
  Bottom 0.813: IC9.6 48.38,207.4 49.67,208.69 49.67,211.96 51.25,213.54 51.35,213.54 53.21,215.4 53.21,218.67 J7.5
N$151
  Bottom 0.813: IC9.9 38.78,207.4 36.64,209.54 36.64,211.32 38.43,213.11 47.66,213.11 49.37,214.82 49.37,218.8 J7.4
N$152  (1 unrouted)
  Bottom 0.813: J7.3 45.45,217.23 43.41,215.19 35.45,215.19 33.84,213.57 | IC9.13 36.92,197.24 36.82,197.13
N$153
  Bottom 0.61: R39.E 90.59,197.73 87.97,199.36 88.09,202.53 89.65,204.09 90.45,205.02 R38.E | R36.E 60.13,194.7 R35.E 55.05,197.22 52.41,199.85 52.41,202.23 R33.E 55,208.3 53.1,209.23 53.1,211.4 53.72,212.02 56.98,212.02 59.62,214.66 59.62,221.81 58.37,223.05 34.01,223.05 31.21,220.25 31.21,217.22 31.13,217.15 31.13,217.46 C6.+ | R48.E 30.92,201.6 33.29,203.98 33.29,204.97 30.96,207.31 30.96,209.9 R34.E
  Bottom 0.813: IC7.OUT 28.7,215.02 C6.+ 31.31,210.33 R34.E | R38.E 90.71,204.96 92.96,204.96 95.2,207.2 95.2,214.94 91.3,218.83 J8.6 81.46,221.14 79.74,222.86 60.67,222.86 59.62,221.81 | R37.E 64.33,209.94 59.62,214.66
N$154  (via drill 0.6 pad 0.61)  (8 unrouted)
  Bottom 0.61: R35.A 58.06,202.8 58.14,206.96 55.13,209.97 R33.A 60.13,209.94 R37.A 65.21,203.45 67.65,200.7 67.65,198.93 65.29,198.05 65.24,194.73 R36.A
  Bottom 0.813: X3.1 19.49,196 C5.- 26.59,195.97 | C6.- 26.46,217.87 26.46,218.42 25.36,219.52 19.35,219.52 18.22,218.39 IC7.GND 18.06,214.86 18.06,212.21 19.54,210.72 24.07,210.72 24.39,210.4 24.39,206.91 26.44,204.86 | R34.A 26.44,204.86 | 26.59,195.97 27.63,195.97 28.86,194.75 30.88,194.75 R48.A | 26.44,204.86 26.44,196.13 26.59,195.97 | LED23.K 21.78,184.69 LED22.K 21.88,181.64 | LED17.K 95.08,184.54 96.94,186.4 96.94,197.74 95.54,199.13 91.26,199.13 R39.A 91.6,199.8 97.35,205.55 97.35,209.82 97.35,209.95 97.35,213.47 v97.33,213.59 | J8.5 77.5,217.54 79.36,215.68 87.65,215.68 90.44,212.89 90.44,212.86 90.59,212.71 90.59,209.96 R38.A | R36.A 62.87,192.36 62.87,190.9 56.51,184.54 LED19.K 54.34,183.98 54.34,178.09 54.42,178.17 | 81.92,202.37 81.26,201.71 78.74,201.71 78.42,201.38 78.42,198.83 78.46,198.78 78.46,186.01 79.93,184.54 LED24.K | LED21.K 31.46,180.02 | 31.46,180.02 31.6,179.88 | 21.88,181.64 19.8,179.57 | LED20.K 42.35,178.67 42.46,178.56 42.46,178.25 42.15,177.94 | 31.46,180.02 31.46,179.51 31.44,179.49 | 21.88,181.64 | 21.88,181.64 19.73,179.49 19.73,177.47 19.57,177.31 | LED18.K 66.48,181.85 62.8,178.17
N$155
  Bottom 0.813: S3.1 4.77,213.83 5.99,215.05 15.65,215.05 IC7.IN 15.68,202.41 17.09,201 19.43,201 C5.+
N$156
  Bottom 0.813: ARDUINO_DUE3.7 65.62,123.07 74.15,131.6 74.15,138.52 J9.1
N$157
  Bottom 0.813: ARDUINO_DUE3.6 63.08,124.26 69.58,130.76 69.58,138.52 J9.2
N$158
  Bottom 0.813: ARDUINO_DUE3.5 60.54,124.98 65.86,130.29 65.86,138.76 J9.3
N$159
  Bottom 0.813: ARDUINO_DUE3.4 58,126.53 58.41,126.94 58.68,126.94 61.76,130.02 61.76,138.03 62.04,138.31 62.04,138.74 J9.4
N$160
  Bottom 0.813: ARDUINO_DUE3.3 55.46,128.56 58.22,131.32 58.22,138.6 J9.5
N$161
  Bottom 0.813: ARDUINO_DUE3.2 52.92,130.21 54.31,131.6 54.31,138.55 J9.6
N$162
  Bottom 0.813: X3.2 3.89,201 1.64,203.25 1.64,207.99 3.2,209.54 4.68,209.54 S3.2
N$163  (via drill 0.6 pad 0.61)
  other vias: 55.35,213.82
N$164  (via drill 0.6 pad 0.61)
  other vias: 84.14,210.26
N$165  (via drill 0.6 pad 0.61)
  other vias: 85.66,222.3
N$166  (via drill 0.6 pad 0.61)
  other vias: 64.35,213.74
N$167  (via drill 0.6 pad 0.61)
  other vias: 71.23,197.44
N$168  (via drill 0.6 pad 0.61)
  other vias: 62.82,178.16
N$169  (via drill 0.6 pad 0.61)
  other vias: 54.37,178.2
N$170  (via drill 0.6 pad 0.61)
  other vias: 42.37,178.26
N$171  (via drill 0.6 pad 0.61)
  other vias: 31.48,179.75
N$172  (via drill 0.6 pad 0.61)
  other vias: 19.62,177.44
N$173  (via drill 0.6 pad 0.61)
  other vias: 49.6,197.3
N$174  (via drill 0.6 pad 0.61)
  other vias: 33.85,213.63
N$175  (via drill 0.6 pad 0.61)
  other vias: 36.9,197.15
N$176  (via drill 0.6 pad 0.61)
  other vias: 90.15,213.27
N$177  (via drill 0.6 pad 0.61)
  other vias: 86.96,213.32
N$178  (via drill 0.6 pad 0.61)
  other vias: 84.18,197.19
N$179  (via drill 0.6)
  other vias: 49.6,202.28
N$180  (via drill 0.6)
  other vias: 57.79,202.45
N$181
  Bottom 0.813: IC11.5 189.87,204.55 R54.S
N$182
  Bottom 0.813: IC11.3 189.87,199.47 R55.S
N$183
  Bottom 0.813: R53.S 172.09,206.9 175.7,204.67 178.34,204.66 IC11.10
N$184
  Bottom 0.813: R52.S 172.86,197.82 174.52,199.48 178.31,199.61 IC11.12
N$185
  Bottom 0.61: R51.S 156.42,196.93 153.88,199.48 IC12.3
N$186
  Bottom 0.813: IC12.5 155.67,204.55 156.74,205.63 156.74,206.98 R49.S
N$187
  Bottom 0.813: R50.S 137.8,206.59 140.06,204.33 143.93,204.33 IC12.10
N$188
  Bottom 0.813: R64.S 137.8,198 139.67,199.87 143.76,199.87 IC12.12
N$189
  Bottom 0.813: R56.1 193.76,180.42 191.12,183.06 | 191.12,183.06 187.56,183.06 184.22,179.72 184.22,176.38 185.69,174.91 191.05,174.91 193.22,172.73 193.22,166.52 190.43,163.73 147.12,163.73 ARDUINO_DUE4.A8 | IC11.1 188.25,194.39 191.19,191.45 191.19,183.13 191.12,183.06
N$190  (1 unrouted)
  Bottom 0.813: ARDUINO_DUE4.A9 146.37,161.94 191.59,161.94 195.55,165.9 195.55,166.21 195.39,166.37 195.39,174.05 189.02,180.42 R57.1 188.93,180.42 195.38,173.98 198.61,173.98 203.76,179.13 203.76,214.73 196.5,221.99 190.13,221.99 | IC11.7 188.18,209.63 188.45,209.91
N$191
  Bottom 0.813: ARDUINO_DUE4.A10 136.95,170.48 139.05,172.04 150.69,172.04 168.38,172.03 170.62,173.83 170.65,177.39 173.52,180.26 178.29,180.27 R58.1 178.46,180.44 178.46,187.16 180.94,189.64 180.94,207.97 179.28,209.63 IC11.8
N$192
  Bottom 0.813: LED26.A 170.82,188.58 172.75,190.51 178.37,190.51 R58.2
N$193
  Bottom 0.813: ARDUINO_DUE4.A11 134.41,172.08 136.3,173.74 144.16,173.74 148.82,173.77 162.91,173.78 164.47,176.5 164.46,180.41 R59.1 166.43,182.37 166.43,187.07 169,189.64 169,189.65 173.74,194.39 IC11.14
N$194
  Bottom 0.813: ARDUINO_DUE4.DAC0 131.87,172.94 134.36,175.46 141.79,175.44 151.03,175.43 153.05,177.35 R60.1 153.89,181.27 153.89,187.65 155.19,188.94 155.19,191.75 152.54,194.39 IC12.1
N$195
  Bottom 0.813: ARDUINO_DUE4.DAC1 129.34,174.14 132.86,177.5 139.51,177.44 139.79,177.44 141.22,178.87 141.22,180.17 R61.1 141.15,180.34 141.15,185.86 144.17,188.88 144.17,189.2 146.81,189.2 148.84,191.41 148.84,193.02 148.89,193.38 148.89,207.64 150.85,209.6 151.74,209.6 IC12.7
N$196
  Bottom 0.813: IC12.8 144.78,209.63 146.58,207.83 146.62,193.28 145.54,192.19 145.53,192.16 140.48,192.16 137.26,189.12 133.38,189.12 129.96,185.7 R62.1 126.79,176.97 ARDUINO_DUE4.CANRX
N$197
  Bottom 0.813: LED27.A 158.12,188.16 160.47,190.51 164.4,190.51 R59.2
N$198
  Bottom 0.813: LED28.A 149.35,186.77 150.18,187.59 150.18,189.54 150.93,190.29 152.75,190.29 R60.2
N$199
  Bottom 0.813: R61.2 140.5,189.4 LED29.A
N$200
  Bottom 0.813: R62.2 129.69,190.3 LED30.A
N$201
  Bottom 0.813: IC12.14 140.04,194.39 137.62,192.05 121.22,192.05 R63.1 114.92,190.51 111.91,187.5 111.91,180.97 114.8,178.09 120.31,178.09 ARDUINO_DUE4.CANTX
N$202
  Bottom 0.813: LED31.A 115.15,186.93 113.68,185.45 113.68,182.47 116.29,179.86 119.27,179.86 R63.2
N$203
  Bottom 0.813: LED25.A 193.68,188.35 195.23,189.89 198.07,189.89 R56.2
N$204
  Bottom 0.813: LED32.A 185.26,188.47 186.74,190.4 188.42,190.4 R57.2
N$205  (1 unrouted)
  Bottom 0.813: IC11.2 188.6,196.93 188.65,196.88 | J11.4 177.89,217.45 181.21,213.58 190.05,213.58 191.23,213.04
N$206
  Bottom 0.61: J11.3 173.92,218.17 178.84,212.13 188.41,212.13 189.92,210.73 189.93,207.8 187.46,207 186.15,207 IC11.6
N$207
  Bottom 0.813: J11.2 169.96,215.25 171.7,213.51 174.87,213.51 175.24,213.14 175.24,208.38 176.54,207.08 178.43,207.08 IC11.9
N$208  (1 unrouted)
  Bottom 0.813: IC11.13 175.64,196.93 175.38,197.19 | J11.1 166,215.97 169.52,212.45
N$209  (1 unrouted)
  Bottom 0.813: IC12.2 153.87,196.93 153.96,197.02 | J10.6 161.68,215.55 159.78,213.65
N$210
  Bottom 0.813: IC12.6 152.73,207.09 154.02,208.38 154.02,211.65 155.6,213.23 155.69,213.23 157.56,215.1 157.56,218.36 J10.5
N$211
  Bottom 0.813: IC12.9 143.13,207.09 140.99,209.23 140.99,211.02 142.78,212.8 152.01,212.8 153.72,214.51 153.72,218.49 J10.4
N$212  (1 unrouted)
  Bottom 0.813: J10.3 149.79,216.92 147.76,214.88 139.8,214.88 138.18,213.26 | IC12.13 141.27,196.93 141.16,196.82
N$213
  Bottom 0.61: R55.E 194.94,197.42 192.32,199.05 192.44,202.22 194,203.78 194.8,204.71 R54.E | R52.E 164.47,194.39 R51.E 159.39,196.91 156.76,199.54 156.76,201.92 R49.E 159.35,207.99 157.44,208.92 157.44,211.09 158.06,211.71 161.32,211.71 163.96,214.35 163.96,221.5 162.72,222.74 138.35,222.74 135.56,219.94 135.56,216.92 135.48,216.84 135.48,217.15 C8.+ | R64.E 135.26,201.29 137.64,203.67 137.64,204.67 135.3,207 135.3,209.6 R50.E
  Bottom 0.813: IC10.OUT 133.05,214.71 C8.+ 135.65,210.02 R50.E | R54.E 195.06,204.65 197.31,204.65 199.54,206.89 199.54,214.63 195.65,218.52 J11.6 185.81,220.83 184.08,222.55 165.02,222.55 163.96,221.5 | R53.E 168.68,209.63 163.96,214.35
N$214  (via drill 0.6 pad 0.61)  (8 unrouted)
  Bottom 0.61: R51.A 162.41,202.49 162.49,206.65 159.47,209.66 R49.A 164.47,209.63 R53.A 169.55,203.14 172,200.39 172,198.62 169.64,197.74 169.58,194.42 R52.A
  Bottom 0.813: X4.1 123.83,195.69 C7.- 130.94,195.66 | C8.- 130.81,217.56 130.81,218.11 129.71,219.21 123.7,219.21 122.56,218.08 IC10.GND 122.4,214.55 122.4,211.9 123.89,210.41 128.42,210.41 128.74,210.09 128.74,206.6 130.79,204.55 | R50.A 130.79,204.55 | 130.94,195.66 131.98,195.66 133.2,194.44 135.22,194.44 R64.A | 130.79,204.55 130.79,195.82 130.94,195.66 | LED31.K 126.13,184.39 LED30.K 126.22,181.33 | LED25.K 199.43,184.23 201.28,186.09 201.28,197.43 199.89,198.82 195.6,198.82 R55.A 195.94,199.49 201.69,205.24 201.69,209.51 201.7,209.64 201.7,213.16 v201.68,213.28 | J11.5 181.85,217.23 183.71,215.38 191.99,215.38 194.79,212.58 194.79,212.55 194.94,212.4 194.94,209.65 R54.A | R52.A 167.21,192.05 167.21,190.59 160.85,184.23 LED27.K 158.68,183.67 158.68,177.78 158.76,177.86 | 186.26,202.06 185.61,201.4 183.09,201.4 182.76,201.07 182.76,198.52 182.81,198.47 182.81,185.7 184.28,184.23 LED32.K | LED29.K 135.81,179.71 | 135.81,179.71 135.95,179.57 | 126.22,181.33 124.15,179.26 | LED28.K 146.69,178.36 146.81,178.25 146.81,177.94 146.5,177.63 | 135.81,179.71 135.81,179.2 135.79,179.18 | 126.22,181.33 | 126.22,181.33 124.07,179.18 124.07,177.16 123.92,177.01 | LED26.K 170.82,181.54 167.14,177.86
N$215
  Bottom 0.813: S4.1 109.12,213.52 110.34,214.74 120,214.74 IC10.IN 120.02,202.1 121.43,200.69 123.78,200.69 C7.+
N$216
  Bottom 0.813: ARDUINO_DUE4.7 169.97,122.76 178.49,131.29 178.49,138.21 J12.1
N$217
  Bottom 0.813: ARDUINO_DUE4.6 167.43,123.95 173.93,130.45 173.93,138.21 J12.2
N$218
  Bottom 0.813: ARDUINO_DUE4.5 164.89,124.67 170.2,129.99 170.2,138.45 J12.3
N$219
  Bottom 0.813: ARDUINO_DUE4.4 162.35,126.22 162.75,126.63 163.03,126.63 166.11,129.71 166.11,137.72 166.39,138 166.39,138.43 J12.4
N$220
  Bottom 0.813: ARDUINO_DUE4.3 159.81,128.25 162.57,131.01 162.57,138.29 J12.5
N$221
  Bottom 0.813: ARDUINO_DUE4.2 157.27,129.9 158.66,131.29 158.66,138.24 J12.6
N$222
  Bottom 0.813: X4.2 108.24,200.69 105.99,202.94 105.99,207.68 107.54,209.23 109.02,209.23 S4.2
N$223  (via drill 0.6 pad 0.61)
  other vias: 159.69,213.51
N$224  (via drill 0.6 pad 0.61)
  other vias: 188.49,209.95
N$225  (via drill 0.6 pad 0.61)
  other vias: 190,221.99
N$226  (via drill 0.6 pad 0.61)
  other vias: 168.69,213.43
N$227  (via drill 0.6 pad 0.61)
  other vias: 175.57,197.13
N$228  (via drill 0.6 pad 0.61)
  other vias: 167.16,177.85
N$229  (via drill 0.6 pad 0.61)
  other vias: 158.71,177.89
N$230  (via drill 0.6 pad 0.61)
  other vias: 146.71,177.96
N$231  (via drill 0.6 pad 0.61)
  other vias: 135.83,179.44
N$232  (via drill 0.6 pad 0.61)
  other vias: 123.96,177.13
N$233  (via drill 0.6 pad 0.61)
  other vias: 153.95,196.99
N$234  (via drill 0.6 pad 0.61)
  other vias: 138.19,213.32
N$235  (via drill 0.6 pad 0.61)
  other vias: 141.24,196.84
N$236  (via drill 0.6 pad 0.61)
  other vias: 194.49,212.97
N$237  (via drill 0.6 pad 0.61)
  other vias: 191.31,213.01
N$238  (via drill 0.6 pad 0.61)
  other vias: 188.52,196.88
N$239  (via drill 0.6)
  other vias: 153.95,201.97
N$240  (via drill 0.6)
  other vias: 162.14,202.14
V+  (1 unrouted)
  Bottom 0.61: IC2.4 85.08,85.36 88.41,88.69 88.54,88.93 90.37,89.44 90.53,92.81 91.07,93.35 | IC3.4 49.73,85.36 49.78,85.41
V+1  (1 unrouted)
  Bottom 0.61: IC4.4 188.06,84.62 191.4,87.95 191.52,88.19 193.36,88.7 193.52,92.07 194.06,92.61 | IC5.4 152.72,84.62 152.76,84.66
V+2  (1 unrouted)
  Bottom 0.61: IC8.4 85.08,202.32 88.41,205.66 88.54,205.89 90.37,206.4 90.53,209.77 91.07,210.32 | IC9.4 49.73,202.32 49.78,202.37
V+3  (1 unrouted)
  Bottom 0.61: IC11.4 189.42,202.01 192.75,205.35 192.88,205.58 194.72,206.09 194.88,209.46 195.42,210.01 | IC12.4 154.08,202.01 154.12,202.06
V-  (1 unrouted)
  Bottom 0.61: IC2.11 70.45,85.36 67.6,88.21 67.55,88.81 65.32,89.59 65.16,92.95 65.21,93
  Bottom 0.813: IC3.11 33.77,85.36 32.76,86.36
V-1  (1 unrouted)
  Bottom 0.61: IC4.11 173.44,84.62 170.59,87.47 170.54,88.07 168.31,88.84 168.14,92.2 168.19,92.25
  Bottom 0.813: IC5.11 136.75,84.62 135.75,85.62
V-2  (1 unrouted)
  Bottom 0.61: IC8.11 70.45,202.32 67.6,205.17 67.55,205.77 65.32,206.55 65.16,209.91 65.21,209.96
  Bottom 0.813: IC9.11 33.77,202.32 32.76,203.33
V-3  (1 unrouted)
  Bottom 0.61: IC11.11 174.79,202.01 171.95,204.86 171.9,205.46 169.67,206.24 169.5,209.6 169.55,209.65
  Bottom 0.813: IC12.11 138.11,202.01 137.11,203.02